# Altium project DC-DC StepDown in Box 45x30x15 (moto).PrjPcb
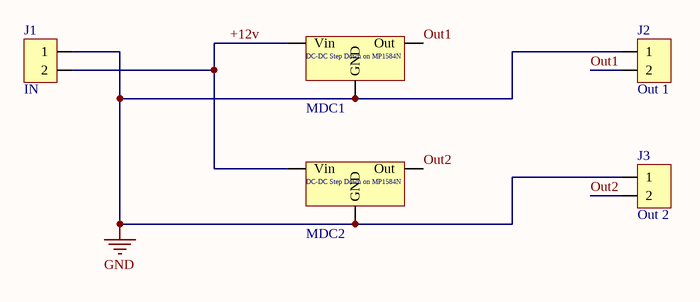
[diagram p0: DC-DC StepDown in Box 45x30x15 (moto).SchDoc]
1 sheet, 5 parts. Net scope: global (net labels, ports and power ports of the same name join across sheets).
Board file: DC-DC StepDown in Box 45x30x15 (moto).PcbDoc

## Sheet DC-DC StepDown in Box 45x30x15 (moto).SchDoc: DC-DC - Moto Charger
size A4

### Parts
J1  IN  [Molex Micro-Fit 3.0 - 2 pin D R]
J2  Out 1  [Molex Micro-Fit 3.0 - 2 pin D R]
J3  Out 2  [Molex Micro-Fit 3.0 - 2 pin D R]
MDC1  DC-DC  [DC-DC_MP1584N]  (value not drawn)
MDC2  DC-DC  [DC-DC_MP1584N]  (value not drawn)

### Nets
GND: J1.1 J2.1 J3.1 MDC1.GND MDC2.GND
+12v: J1.2 MDC1.IN(Vin) MDC2.IN(Vin)
Out1: J2.2 MDC1.OUT(Out)
Out2: J3.2 MDC2.OUT(Out)

### Notes on the sheet
- Title
- Size:
- Date:
- A4
- Number:
- Time:
- Revision:
- Sheet
- of
- File:
- (in symbol DC-DC MP1584N) DC-DC Step Down on MP1584N

### Library data of the parts
J1-J3 = Micro-Fit 2R (1x2): Horisontal, Dbl line, Male - 3mm; Part Number: 430450200; Name: Micro-Fit 3.0; URL: http://www.molex.com/molex/products/datasheet.jsp?part=active/0430450200_PCB_HEADERS.xml
MDC1 MDC2 = DC-DC MP1584N: DC-DC StepDown